# EAGLE design circle_humidity (EAGLE 7.4.0)
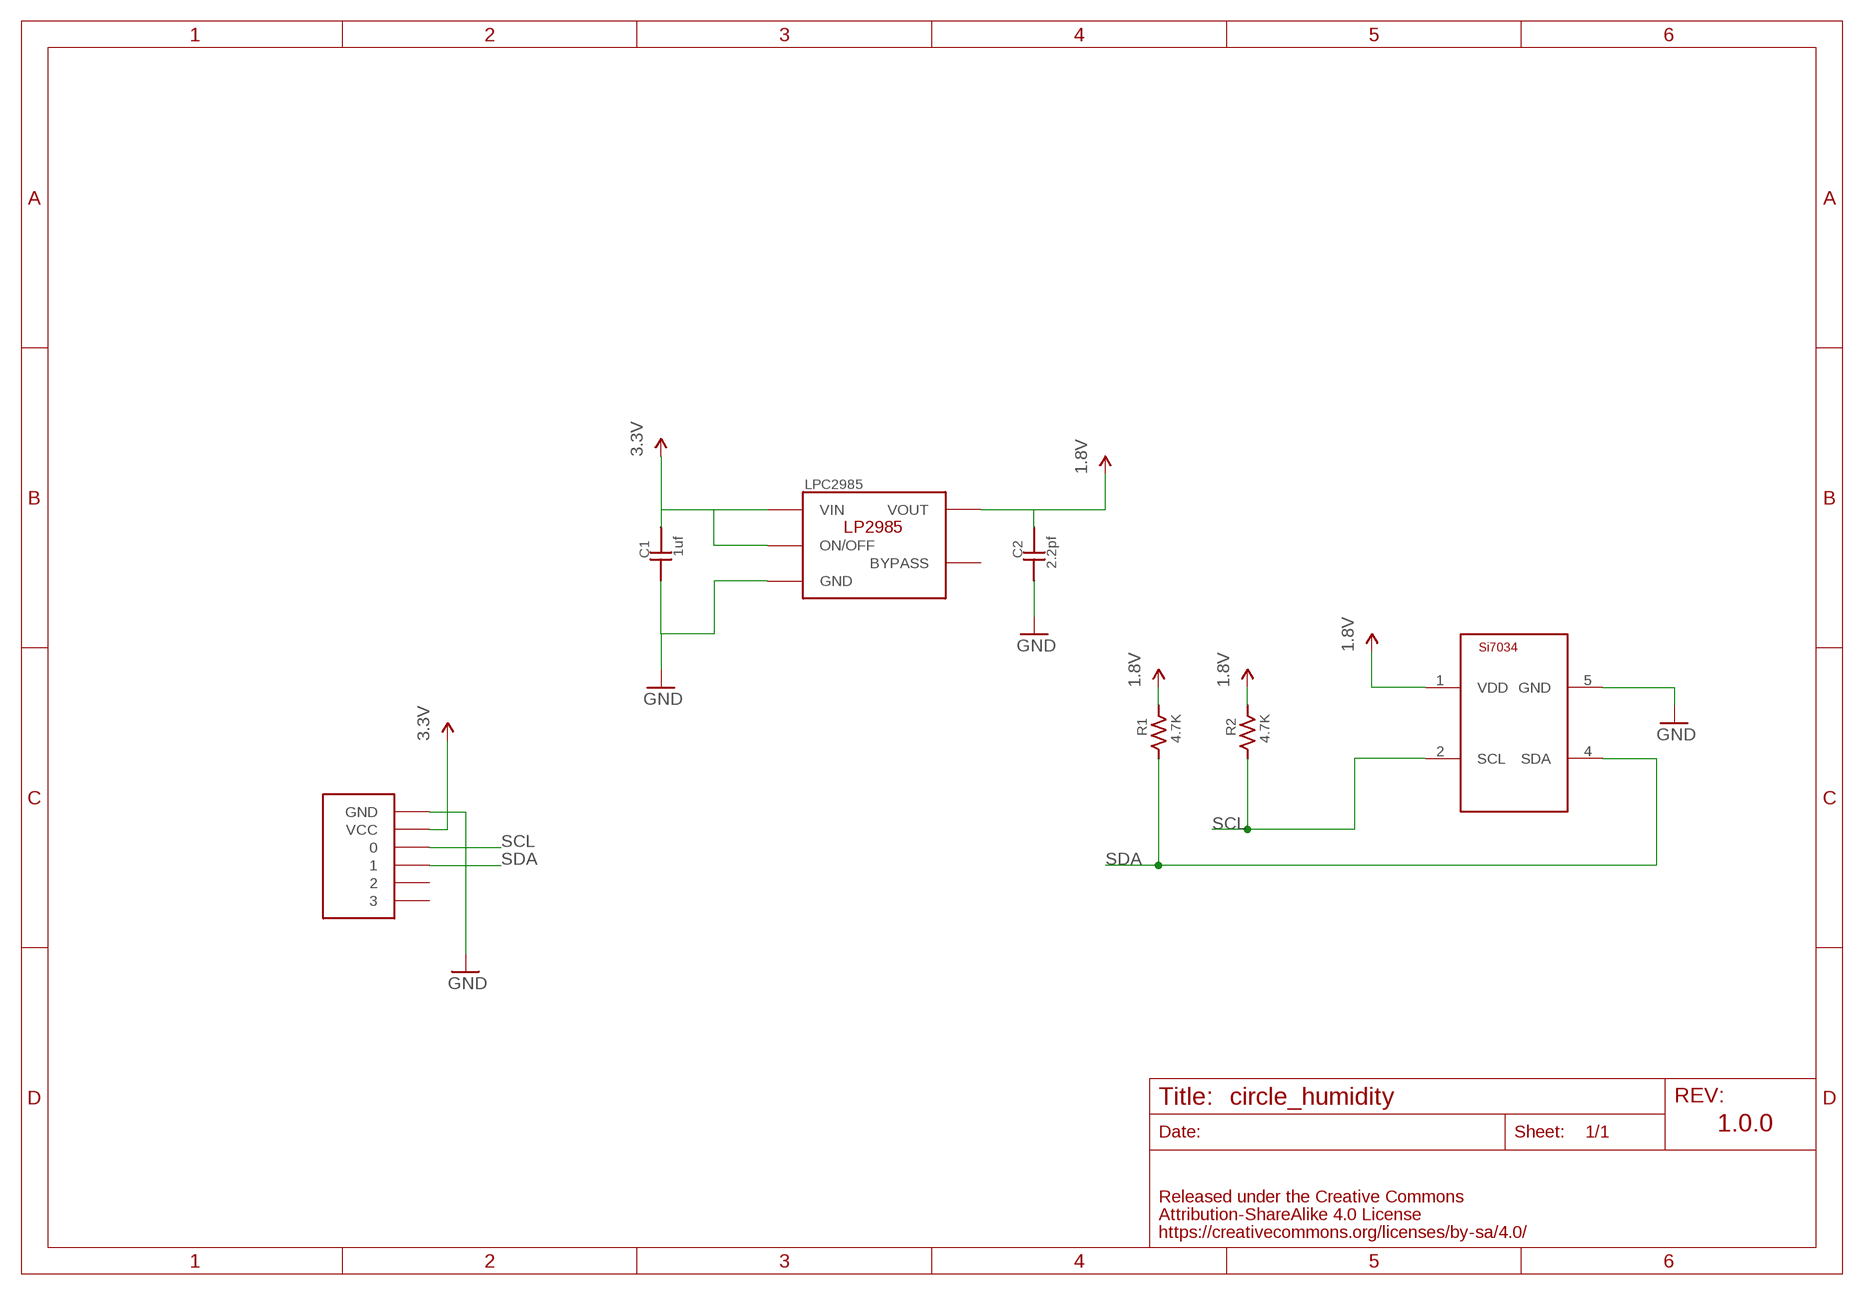
[diagram p0: schematic, sheet 1]

## Parts
C1  1uf  CAPACITOR0402  [0402]
C2  2.2pf  CAPACITOR0402  [0402]
LPC2985  TI-LP2985-18DBVT  [TI-LP2985]
R1  4.7K  RESISTOR-0402  [0402]
R2  4.7K  RESISTOR-0402  [0402]
U$5  FABO-NANO  [FABO-NANO]
U$6  SILICONLABS-SI7034  [SILICONLABS-SI7034]

## Nets
1.8V: C2.P$2 LPC2985.5(VOUT) R1.P$2 R2.P$2 U$6.1(VDD)
3.3V: C1.P$2 LPC2985.1(VIN) LPC2985.3(ON/OFF) U$5.VCC
GND: C1.P$1 C2.P$1 LPC2985.2(GND) U$5.GND U$6.5(GND)
SCL: R2.P$1 U$5.0 U$6.2(SCL)
SDA: R1.P$1 U$5.1 U$6.4(SDA)
Unconnected: LPC2985.4(BYPASS) U$5.2 U$5.3

## Notes on the sheet
- 1.0.0

## Library data of the parts
C1 C2 = FaBo-Capacitor:CAPACITOR: CAPACITOR
LPC2985 = FaBo-Supply:TI-LP2985: LP2985
R1 R2 = FaBo-Resistors:RESISTOR: RESISTOR
U$5 = FaBo-Template:FABO-NANO
U$6 = FaBo-Mems:SILICONLABS-SI7034

## Board
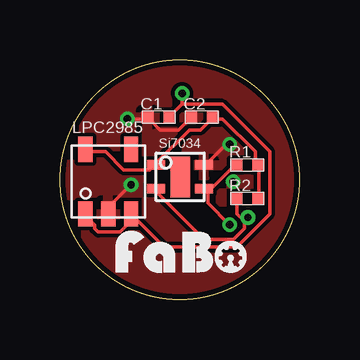
[diagram p1: board, top side]
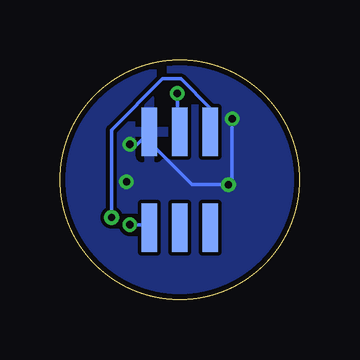
[diagram p2: board, bottom side, seen from below]

Size 10 x 10 mm. Coordinates in mm from the lower left corner, seen from the top.
Copper layers (1*16): Top 0.035mm / dielectric 1.5mm / Bottom 0.035mm
Design rules "Elecrow_2-layer_eagle_rule": minimum track width 6mil, minimum drill 12mil, track to track 6mil, track to pad 6mil, pad to pad 6mil, via to via 6mil, smd to smd 0mil, copper to edge 10mil, drill to drill 10mil, minimum pad ring 10mil, minimum via ring 6mil, stop-mask expansion 2mil, vias tented up to drill 100mil, thermal gap 10mil

### Footprints (pad centres in the part's own frame; a part is rotated, then mirrored left to right if it is on the bottom)
0402 = smd 0.5 x 0.5: P$1 -0.46,0; P$2 0.46,0
TI-LP2985 = smd 0.6 x 1.05: 1 -0.95,-1.35; 2 0,-1.35; 3 0.95,-1.35; 4 0.95,1.35; 5 -0.95,1.35
FABO-NANO = smd 0.635 x 2.032 bottom: 0 -1.27,2; 1 1.27,-2; 2 0,-2; 3 -1.27,-2; GND 1.27,2; VCC 0,2
SILICONLABS-SI7034 = smd 0.75 x 0.4: 1 -1,0.5; 2 -1,-0.5; 4 1,-0.5; 5 1,0.5 | smd 0.8 x 1.7: 36 0,0

### Placement (x,y rotation side)
C1  4.12,7.62 0 top
C2  5.92,7.62 0 top
LPC2985  2.02,4.92 0 top
R1  7.82,5.62 0 top
R2  7.82,4.22 0 top
U$2  [LOGO_FABO_S]  5.12,1.12 0 top
U$5  5,5 0 top
U$6  5.02,5.12 0 top

### Tracks (layer width: path | path; a pad name or v marks a point on that pad's centre or on a via)
1.8V
  Top 0.152: R2.P$2 8.3,4.34 8.3,5.56 R1.P$2 8.15,5.71 8.15,6.17 6.78,7.54 6.47,7.54 C2.P$2 6.32,7.54 5.86,7.08 5.41,7.08 4.04,5.71 U$6.1 3.88,5.56 3.73,5.41 2.66,5.41 1.9,6.17 1.14,6.17 LPC2985.5
3.3V  (via drill 0.3)
  Top 0.152: 5.1,8.15 4.64,7.69 C1.P$2 | 5.1,8.15 6.78,8.15 8.76,6.17 8.76,3.58 7.39,2.21 4.34,2.21 3.12,3.42 | 3.12,3.42 2.51,2.82 1.6,2.82 1.44,2.97 1.44,3.12 1.14,3.42 LPC2985.1 | 3.12,3.42 LPC2985.3 | 5.1,8.15 v5.1,8.61
  Bottom 0.152: v5.1,8.61 5.1,7.08 U$5.VCC
GND  (via drill 0.3)
  Top 0.152: C2.P$1 5.41,7.54 4.95,7.08 4.19,7.08 3.73,7.54 C1.P$1 3.58,7.54 v2.82,7.54 | v7.08,6.47 6.93,6.47 6.17,5.71 U$6.5 | v2.97,4.8 2.05,3.88 2.05,3.58 LPC2985.2
  Bottom 0.152: v7.08,6.47 6.78,6.47 6.47,6.78 | 6.47,6.78 6.32,6.93 U$5.GND 6.47,6.78 | 6.47,6.78 4.49,4.8 v2.97,4.8 2.82,4.95 v2.82,7.54
  other vias: 7.22,4.92
  pour Bottom: -0.18,-0.08 10.32,-0.08 10.32,10.22 -0.18,10.22
  pour Top: -0.08,-0.08 10.32,-0.08 10.32,10.22 -0.08,10.22
SCL  (via drill 0.3)
  Top 0.152: 7.69,3.27 7.39,3.58 7.39,4.19 R2.P$1 | 7.69,3.27 7.69,2.97 7.24,2.51 6.02,2.51 4.04,4.49 U$6.2 | 7.69,3.27 v7.84,3.42
  Bottom 0.152: U$5.0 3.73,8 4.95,9.22 5.71,9.22 7.84,7.08 v7.84,3.42
SDA  (via drill 0.3)
  Top 0.152: 6.17,4.49 7.24,5.56 R1.P$1 | 6.17,4.49 6.17,4.04 v7.08,3.12 | 6.17,4.49 U$6.4
  Bottom 0.152: v7.08,3.12 6.32,3.12 U$5.1